# EAGLE design esp_dht (EAGLE 7.7.0)
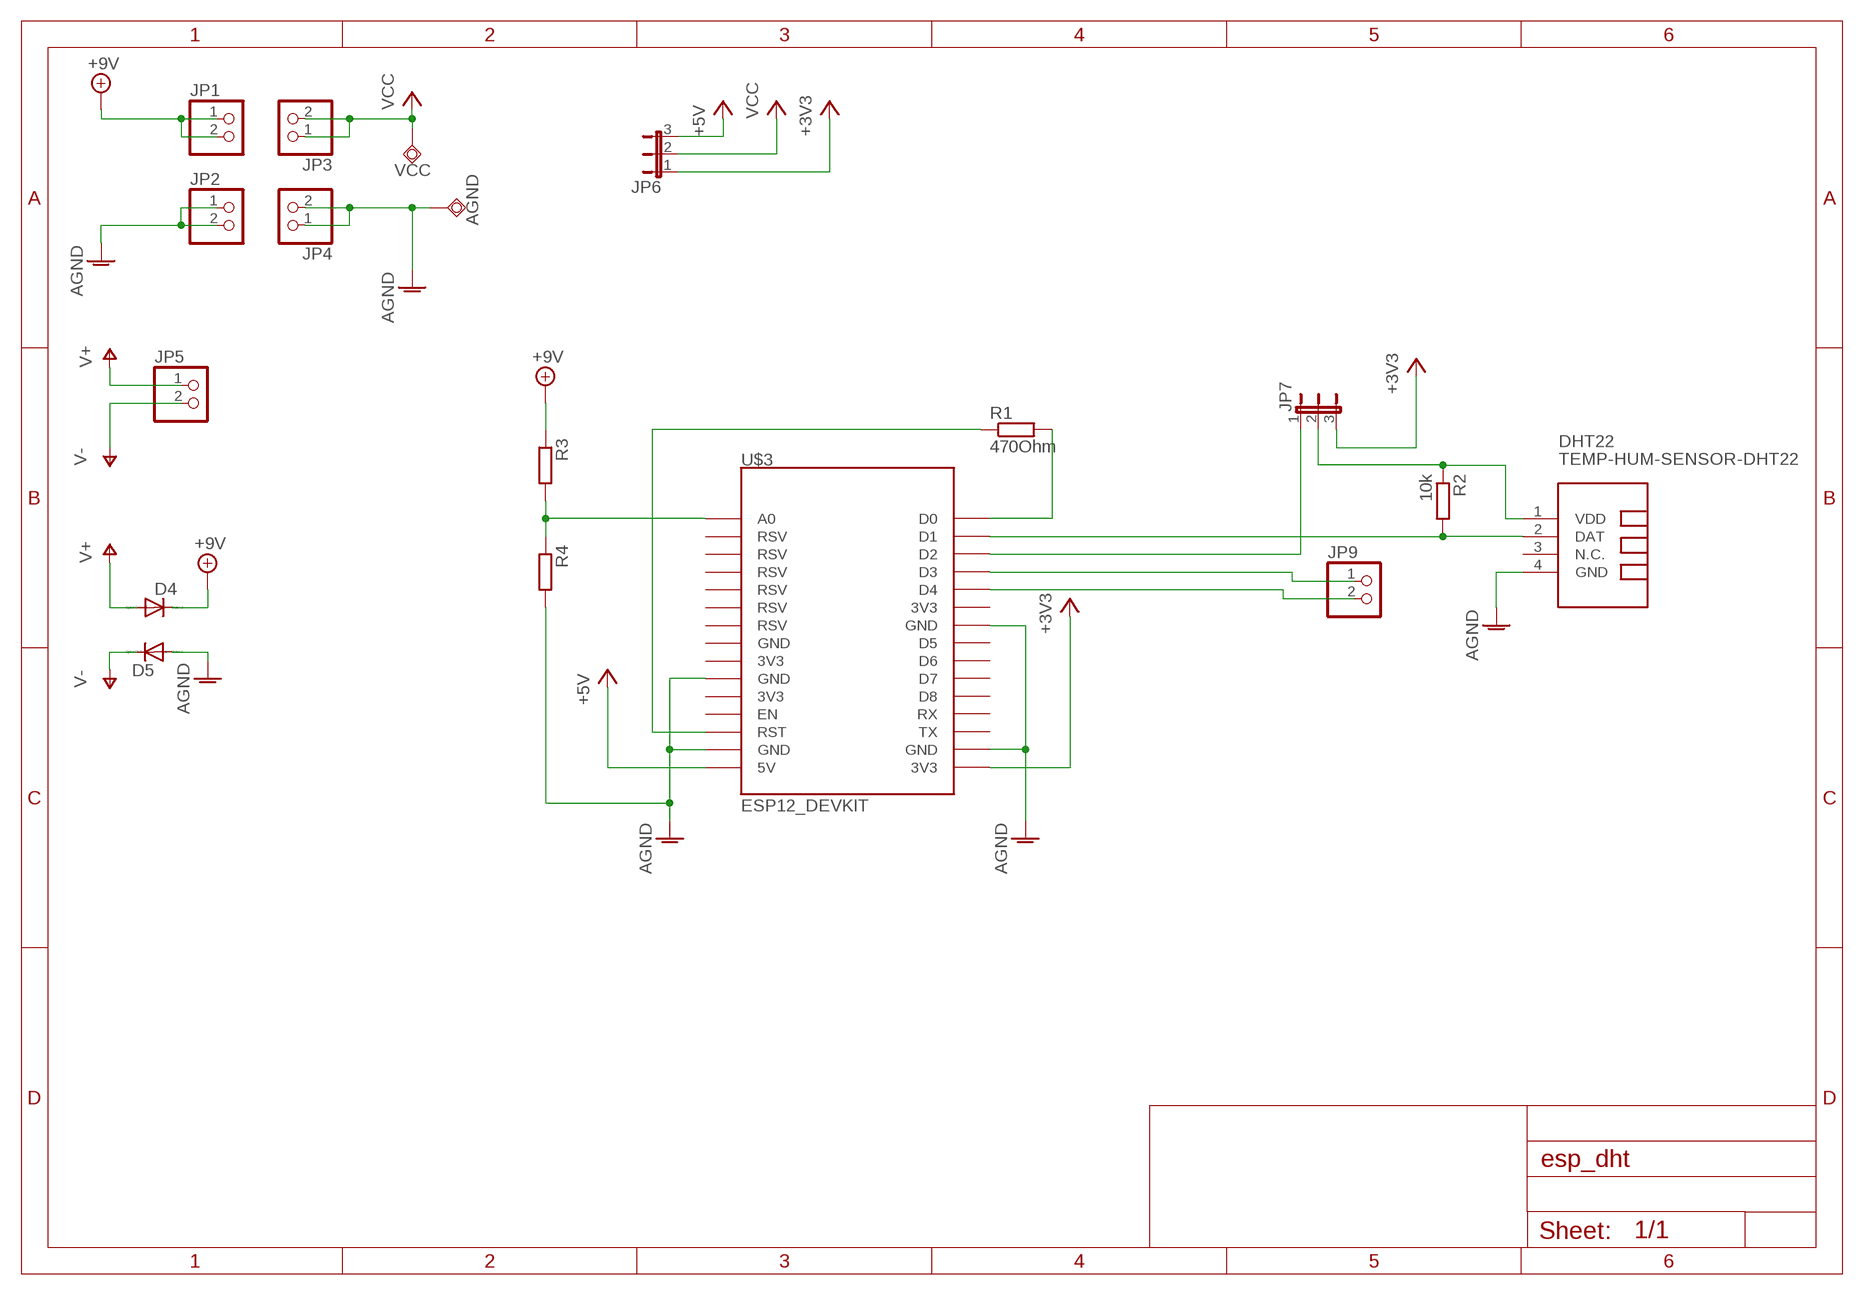
[diagram p0: schematic, sheet 1]

## Parts
AGND  TPSQTP20SQ  [TP20SQ]
D4  1N4148DO35-7  [DO35-7]
D5  1N4148DO35-7  [DO35-7]
DHT22  TEMP-HUM-SENSOR-DHT22  [TEMP-HUM-SENSOR-DHT22]
JP1  PINHD-1X2  [1X02]
JP2  PINHD-1X2  [1X02]
JP3  PINHD-1X2  [1X02]
JP4  PINHD-1X2  [1X02]
JP5  PINHD-1X2  [1X02]
JP6  JP2E  [JP2]
JP7  JP2E  [JP2]
JP9  PINHD-1X2  [1X02]
R1  470Ohm  R-EU_R0805  [R0805]
R2  10k  R-EU_R0805  [R0805]
R3  R-EU_R0805  [R0805]
R4  R-EU_R0805  [R0805]
U$3  ESP12_DEVKIT  [ESP12_DEVKIT]
VCC  TPSQTP20SQ  [TP20SQ]

## Nets
+3V3: JP6.1 JP7.3 U$3.3V3@2(3V3)
+5V: JP6.3 U$3.5V
+9V: D4.C JP1.1 JP1.2 R3.1
AGND: AGND.TP D5.A DHT22.4(GND) JP2.1 JP2.2 JP4.1 JP4.2 R4.2 U$3.GND@0(GND) U$3.GND@1(GND) U$3.GND@2(GND) U$3.GND@3(GND)
DHT_BUS: DHT22.2(DAT) R2.2 U$3.D1
DHT_PWR: DHT22.1(VDD) JP7.2 R2.1
N$1: R1.1 U$3.RST
N$2: R1.2 U$3.D0
N$3: JP7.1 U$3.D2
N$4: JP9.2 U$3.D4
N$8: R3.2 R4.1 U$3.A0
N$12: JP9.1 U$3.D3
V+: D4.A JP5.1
V-: D5.C JP5.2
VCC: JP3.1 JP3.2 JP6.2 VCC.TP
Unconnected: DHT22.3(N.C.) U$3.3V3@0(3V3) U$3.3V3@1(3V3) U$3.3V3@3(3V3) U$3.D5 U$3.D6 U$3.D7 U$3.D8 U$3.EN U$3.GND@4(GND) U$3.RSV@0(RSV) U$3.RSV@1(RSV) U$3.RSV@2(RSV) U$3.RSV@3(RSV) U$3.RSV@4(RSV) U$3.RSV@5(RSV) U$3.RX U$3.TX

## Library data of the parts
AGND VCC = testpad:TPSQ: Test pad
D4 D5 = diode:1N4148: DIODE high speed (Philips)
DHT22 = diy-modules:TEMP-HUM-SENSOR-DHT22: DHT22 - digital humidity & temperature sensor Also known as: AM2302 AM2302 datasheet available here: http://akizukidenshi.com/download/ds/aosong/AM2302.pdf Click here to find device on ebay.com <http://www.ebay.com/sch/dht22+digital+sensor>
JP1-JP5 JP9 = pinhead:PINHD-1X2: PIN HEADER
JP6 JP7 = jumper:JP2E: JUMPER
R1-R4 = rcl:R-EU_: RESISTOR, European symbol
U$3 = SWI_COMMONS:ESP12_DEVKIT: ESP12 DEVKIT BOARD

## Board
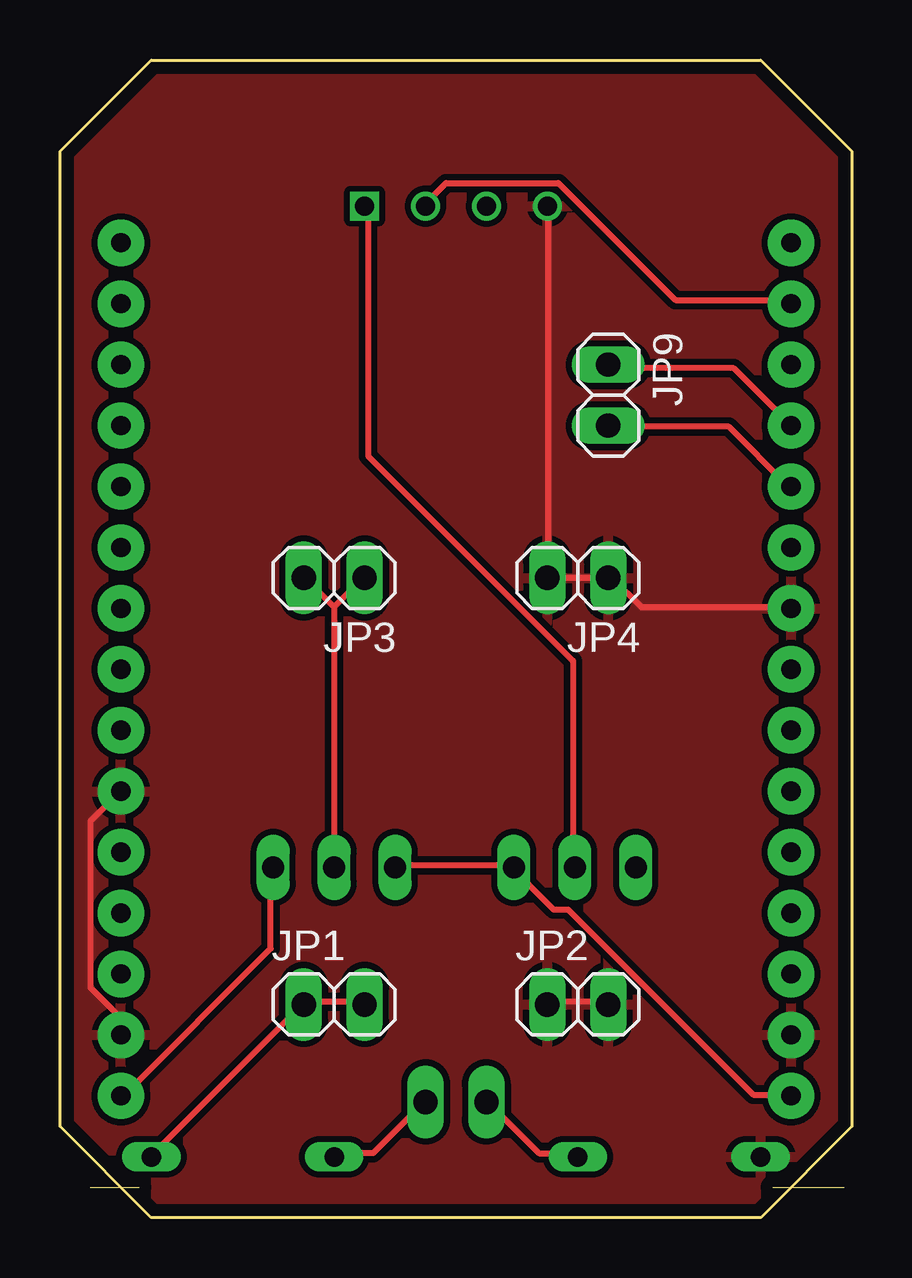
[diagram p1: board, top side]
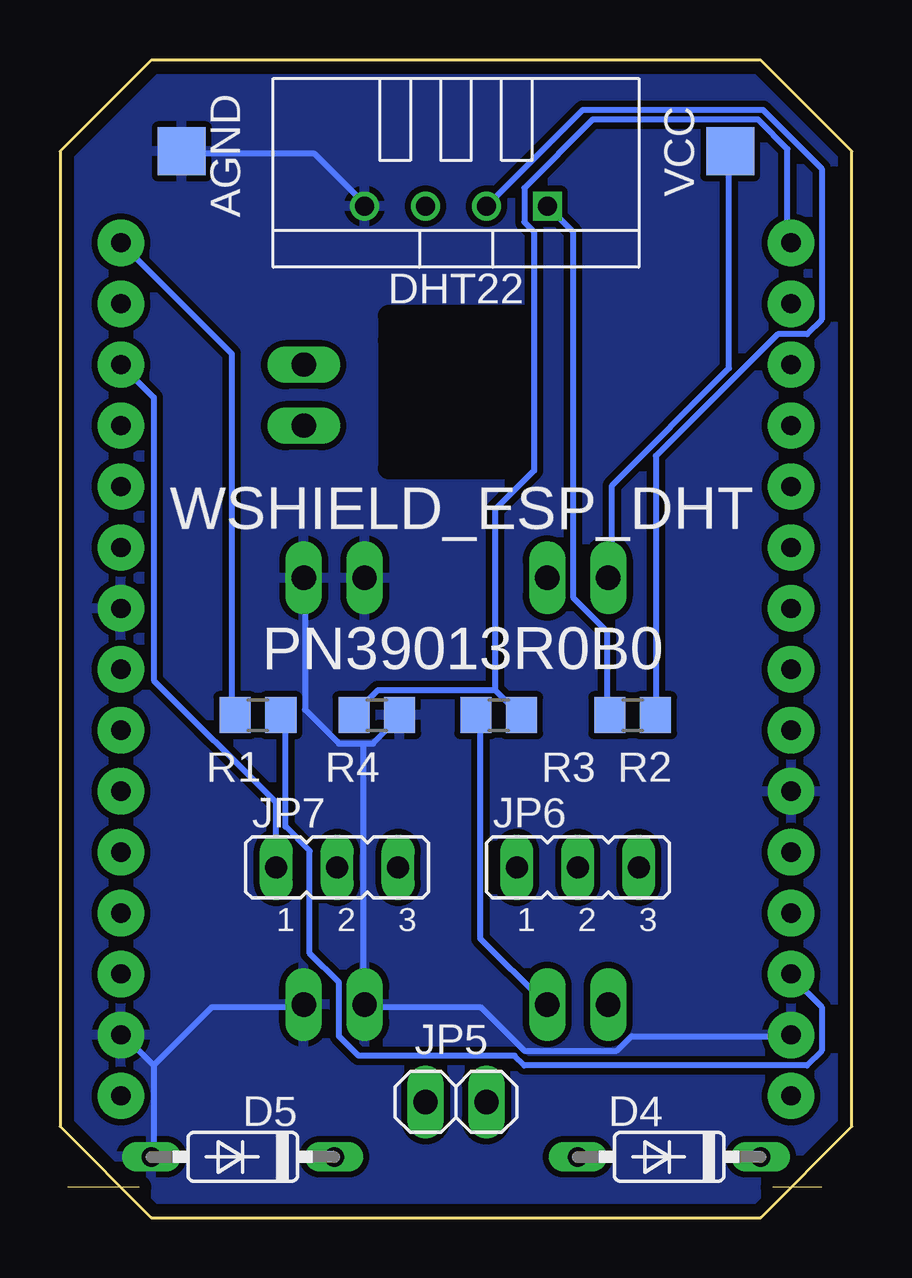
[diagram p2: board, bottom side, seen from below]

Size 33.02 x 48.26 mm. Coordinates in mm from the lower left corner, seen from the top.
Outline: 1.27,1.27 3.3,1.27
Outline: 29.72,1.27 32.69,1.27
Copper layers (1*16): Top 0.035mm / dielectric 1.6mm / Bottom 0.035mm
Design rules "Elecrow_2-layer_PCB_eagle_rule *": minimum track width 10mil, minimum drill 12mil, track to track 6mil, track to pad 6mil, pad to pad 6mil, via to via 8mil, smd to smd 0mil, copper to edge 20mil, drill to drill 10mil, minimum pad ring 6mil, minimum via ring 6mil, stop-mask expansion 0mil, vias tented up to drill 100mil, thermal gap 10mil
bRestrict: area 13.7,31.2 to 19.3,37.6

### Footprints (pad centres in the part's own frame; a part is rotated, then mirrored left to right if it is on the bottom)
TP20SQ = smd 2 x 2: TP 0,0
DO35-7 = drill 0.813 long: A 3.81,0; C -3.81,0
TEMP-HUM-SENSOR-DHT22 = drill 0.8 square: 1 -3.81,0 | drill 0.8: 2 -1.27,0; 3 1.27,0; 4 3.81,0
1X02 = drill 1.016 long: 1 -1.27,0; 2 1.27,0
JP2 = drill 0.914 long: 1 -2.54,0; 2 0,0; 3 2.54,0
R0805 = smd 1.3 x 1.5: 1 -0.95,0; 2 0.95,0
ESP12_DEVKIT = drill 0.8 pad 1.93: 3V3@0 -13.97,-7.62; 3V3@1 13.97,5.08; 3V3@2 13.97,-17.78; 3V3@3 -13.97,-2.54; 5V -13.97,-17.78; A0 -13.97,17.78; D0 13.97,17.78; D1 13.97,15.24; D2 13.97,12.7; D3 13.97,10.16; D4 13.97,7.62; D5 13.97,0; D6 13.97,-2.54; D7 13.97,-5.08; D8 13.97,-7.62; EN -13.97,-10.16; GND@0 -13.97,-5.08; GND@1 -13.97,-15.24; GND@2 13.97,2.54; GND@3 13.97,-15.24; GND@4 -13.97,0; RST -13.97,-12.7; RSV@0 -13.97,15.24; RSV@1 -13.97,12.7; RSV@2 -13.97,10.16; RSV@3 -13.97,7.62; RSV@4 -13.97,5.08; RSV@5 -13.97,2.54; RX 13.97,-10.16; TX 13.97,-12.7

### Placement (x,y rotation side)
AGND  27.94,44.45 270 bottom
D4  7.62,2.54 180 bottom
D5  25.4,2.54 180 bottom
DHT22  16.51,42.16 180 bottom
JP1  11.43,8.89 0 top
JP2  21.59,8.89 0 top
JP3  11.43,26.67 180 top
JP4  21.59,26.67 180 top
JP5  16.51,4.83 180 bottom
JP6  11.43,14.61 0 bottom
JP7  21.46,14.61 0 bottom
JP9  22.86,34.29 270 top
R1  24.77,20.95 180 bottom
R2  9.14,20.95 0 bottom
R3  14.73,20.95 0 bottom
R4  19.81,20.95 0 bottom
U$3  16.51,22.86 0 top
VCC  5.08,44.45 270 bottom

### Tracks (layer width: path | path; a pad name or v marks a point on that pad's centre or on a via)
+3V3
  Top 0.254: JP6.1 14.07,14.68 18.75,14.68 JP7.3 18.95,14.48 20.57,12.85 21.18,12.85 28.91,5.13 30.33,5.13 U$3.3V3@2
+5V
  Top 0.254: JP6.3 8.79,14.48 8.79,11.23 2.69,5.13 U$3.5V
+9V
  Top 0.254: D4.C 3.91,2.69 10.01,8.79 JP1.1 10.21,8.99 12.65,8.99 JP1.2
  Bottom 0.254: R3.1 15.49,20.78 15.49,11.63 12.85,8.99 JP1.2
AGND
  Top 0.254: 20.37,26.67 JP4.1 23.01,26.67 24.23,25.45 30.33,25.45 U$3.GND@2 | 20.37,26.67 20.37,42.11 DHT22.4 | 20.37,26.67 JP4.2 | U$3.GND@0 1.27,16.51 1.27,9.6 2.49,8.38 2.49,7.77 U$3.GND@1 | JP2.1 20.37,8.99 22.81,8.99 JP2.2
  Bottom 0.254: AGND.TP 27.89,44.35 22.4,44.35 20.37,42.32 DHT22.4 | 20.37,19.76 21.39,19.76 22.81,21.18 22.81,26.67 JP4.1 | 20.37,19.76 19.96,19.76 18.95,20.78 R4.2 | 29.11,6.35 29.11,2.69 D5.A | 29.11,6.35 30.33,7.57 U$3.GND@3 | 29.11,6.35 26.67,8.79 23.01,8.79 JP2.2 | U$3.GND@1 2.69,7.57 9.2,7.57 9.8,6.96 13.67,6.96 15.49,8.79 20.17,8.79 JP2.1 20.37,8.99 20.37,19.76
  pour Top (isolate 0.254): 0,42.42 0,44.45 3.81,48.26 29.21,48.26 33.02,44.45 33.02,3.81 29.21,0 4.06,0 3.81,0 0,3.81
  pour Bottom (isolate 0.254): 0,42.42 0,44.45 3.81,48.26 29.21,48.26 33.02,44.45 33.02,3.81 29.21,0 3.81,0 0,3.81
DHT_BUS
  Top 0.254: U$3.D1 30.33,38.25 25.65,38.25 20.78,43.13 16.1,43.13 15.29,42.32 DHT22.2
  Bottom 0.254: DHT22.2 11.23,46.18 3.71,46.18 1.27,43.74 1.27,37.44 1.88,36.83 3.1,36.83 8.18,31.75 8.18,20.98 R2.2
DHT_PWR
  Top 0.254: JP7.2 21.39,14.68 21.39,23.22 12.85,31.75 12.85,42.11 DHT22.1
  Bottom 0.254: DHT22.1 11.63,41.1 11.63,25.86 10.21,24.43 10.21,20.98 R2.1
N$1
  Bottom 0.254: R1.1 23.62,20.78 23.62,16.31 22.61,15.29 22.61,11.02 21.39,9.8 21.39,7.57 20.57,6.76 14.07,6.76 13.67,6.35 1.88,6.35 1.27,6.96 1.27,8.79 2.49,10.01 U$3.RST
N$2
  Bottom 0.254: U$3.D0 25.86,36.02 25.86,20.98 R1.2
N$3
  Bottom 0.254: U$3.D2 29.11,34.19 29.11,22.4 24.03,17.32 24.03,14.68 JP7.1
N$4
  Top 0.254: JP9.2 23.01,32.97 27.89,32.97 30.33,30.53 U$3.D4
N$8
  Bottom 0.254: 14.88,22 13.87,20.98 R3.2 | 14.88,22 19.76,22 20.78,20.98 R4.1 | 14.88,22 14.88,29.52 13.26,31.14 13.26,41.1 13.67,41.5 13.67,42.93 10.82,45.77 3.91,45.77 2.69,44.55 2.69,40.69 U$3.A0
N$12
  Top 0.254: U$3.D3 28.09,35.41 23.01,35.41 JP9.1
V+
  Top 0.254: D4.A 11.43,2.69 13.06,2.69 15.09,4.72 JP5.1
V-
  Top 0.254: D5.C 21.59,2.69 19.96,2.69 17.93,4.72 JP5.2
VCC
  Top 0.254: 11.43,25.45 JP6.2 | 11.43,25.45 10.21,26.67 JP3.2 | 11.43,25.45 12.65,26.67 JP3.1
  Bottom 0.254: VCC.TP 5.13,44.35 5.13,35.41 10.01,30.53 10.01,26.67 JP3.2

### Text on the board
bNames: WSHIELD_ESP_DHT | PN39013R0B0